# EAGLE design lp_numi (EAGLE 6.6.0)
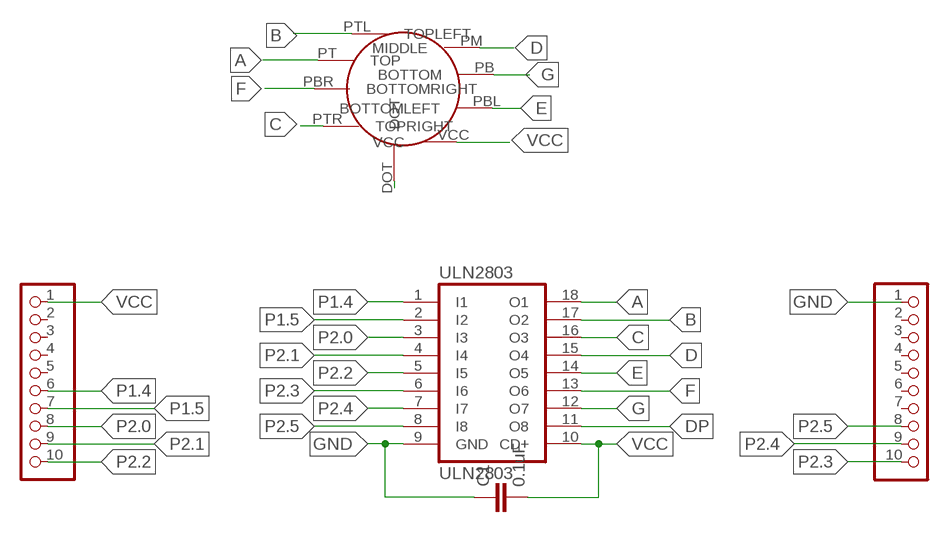
[diagram p0: schematic, sheet 1]

## Parts
C1  0.1uF  C-EU025-025X050  [C025-025X050]
J1  J1  PINHD-1X10  [1X10]
J2  J2  PINHD-1X10  [1X10]
U$2  IV16TINY_NUMITRON  [IV16TINY_NUMITRON_PAC]
ULN2803  ULN2803  ULN2803A  [DIL18]

## Nets
A: U$2.PT(TOP) ULN2803.18(O1)
B: U$2.PTL(TOPLEFT) ULN2803.17(O2)
C: U$2.PTR(TOPRIGHT) ULN2803.16(O3)
D: U$2.PM(MIDDLE) ULN2803.15(O4)
DP: U$2.DOT ULN2803.11(O8)
E: U$2.PBL(BOTTOMLEFT) ULN2803.14(O5)
F: U$2.PBR(BOTTOMRIGHT) ULN2803.13(O6)
G: U$2.PB(BOTTOM) ULN2803.12(O7)
GND: C1.1 J2.1 ULN2803.9(GND)
P1.4: J1.6 ULN2803.1(I1)
P1.5: J1.7 ULN2803.2(I2)
P2.0: J1.8 ULN2803.3(I3)
P2.1: J1.9 ULN2803.4(I4)
P2.2: J1.10 ULN2803.5(I5)
P2.3: J2.10 ULN2803.6(I6)
P2.4: J2.9 ULN2803.7(I7)
P2.5: J2.8 ULN2803.8(I8)
VCC [VCC]: C1.2 J1.1 U$2.VCC ULN2803.10(CD+)
Unconnected: J1.2 J1.3 J1.4 J1.5 J2.2 J2.3 J2.4 J2.5 J2.6 J2.7

## Library data of the parts
C1 = resistor:C-EU: CAPACITOR, European symbol
J1 J2 = pinhead:PINHD-1X10: PIN HEADER
U$2 = kalshagar:IV16TINY_NUMITRON
ULN2803 = uln-udn:ULN2803A: DRIVER ARRAY

## Net classes
0 default: width 0.406 mm, drill 0.508 mm
1 GND: width 0.813 mm, drill 0.508 mm
2 VCC: width 1.016 mm, drill 0.508 mm

## Board
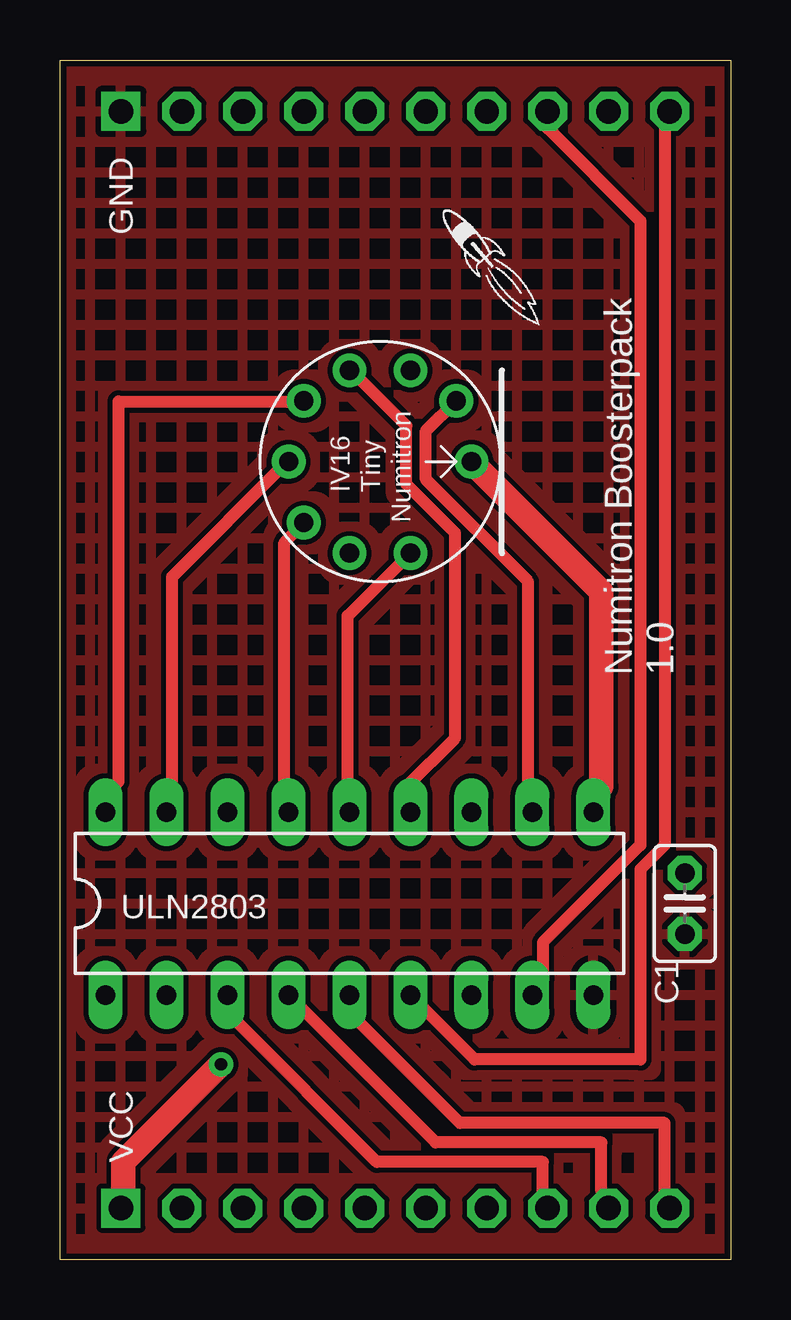
[diagram p1: board, top side]
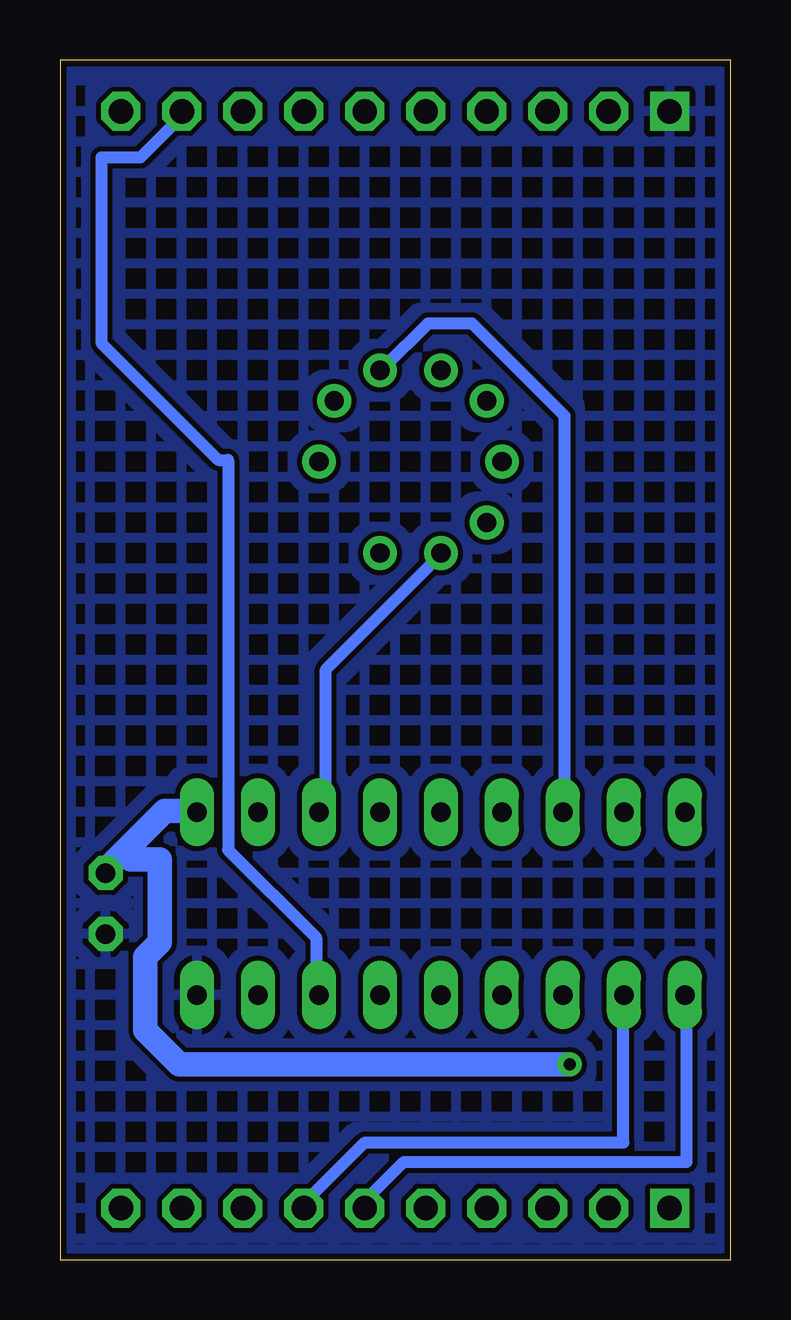
[diagram p2: board, bottom side, seen from below]

Size 27.94 x 50 mm. Coordinates in mm from the lower left corner, seen from the top.
Outline: 0,50 27.94,50 27.94,0 0,0 0,50
Copper layers (1*16): Top 0.035mm / dielectric 1.5mm / Bottom 0.035mm
Design rules "SparkFun *": minimum track width 20mil, minimum drill 20mil, track to track 8mil, track to pad 8mil, pad to pad 8mil, via to via 8mil, smd to smd 8mil, copper to edge 10mil, drill to drill 8mil, minimum pad ring 12mil, minimum via ring 10mil, stop-mask expansion 4mil, vias tented up to drill 25mil, thermal gap 10mil

### Footprints (pad centres in the part's own frame; a part is rotated, then mirrored left to right if it is on the bottom)
C025-025X050 = drill 0.813 octagon: 1 -1.27,0; 2 1.27,0
1X10 = drill 1.016 square: 1 -11.43,0 | drill 1.016 octagon: 2 -8.89,0; 3 -6.35,0; 4 -3.81,0; 5 -1.27,0; 6 1.27,0; 7 3.81,0; 8 6.35,0; 9 8.89,0; 10 11.43,0
IV16TINY_NUMITRON_PAC = drill 0.8: DOT 2.54,-3.175; PB -3.81,1.27; PBL -3.81,-1.27; PBR 3.81,1.27; PM -2.54,3.175; PT 2.54,3.175; PTL 0,3.81; PTR 3.81,-1.27; VCC 0,-3.81
DIL18 = drill 0.813 long: 1 -10.16,-3.81; 2 -7.62,-3.81; 3 -5.08,-3.81; 4 -2.54,-3.81; 5 0,-3.81; 6 2.54,-3.81; 7 5.08,-3.81; 8 7.62,-3.81; 9 10.16,-3.81; 10 10.16,3.81; 11 7.62,3.81; 12 5.08,3.81; 13 2.54,3.81; 14 0,3.81; 15 -2.54,3.81; 16 -5.08,3.81; 17 -7.62,3.81; 18 -10.16,3.81

### Placement (x,y rotation side)
C1  26.04,14.84 90 top
J1  13.97,2.14 0 top
J2  13.97,47.86 0 top
U$1  [LOGO-ROCKET]  17.78,41.51 90 top
U$2  13.34,33.26 90 top
ULN2803  12.06,14.84 0 top

### Tracks (layer width: path | path; a pad name or v marks a point on that pad's centre or on a via)
A
  Top 0.508: U$2.PT 10.16,35.77 2.44,35.77 2.44,19.92 2.03,19.51 2.03,18.7 ULN2803.18
B
  Top 0.508: U$2.PTL 9.35,33.13 4.67,28.45 4.67,18.9 4.47,18.7 ULN2803.17
C
  Bottom 0.508: U$2.PTR 14.43,37.19 12.6,39.02 10.77,39.02 6.91,35.16 6.91,18.7 ULN2803.16
D
  Top 0.508: U$2.PM 10.16,30.69 9.35,29.88 9.35,18.7 ULN2803.15
DP
  Top 0.508: U$2.DOT 16.46,35.77 15.24,34.55 15.24,32.52 19.51,28.25 19.51,18.7 ULN2803.11
E
  Top 0.508: U$2.PBL 11.99,26.83 11.99,18.7 ULN2803.14
F
  Top 0.508: U$2.PBR 12.19,36.99 14.43,34.75 14.43,32.32 16.46,30.28 16.46,21.75 14.43,19.72 14.43,18.7 ULN2803.13
G
  Bottom 0.508: U$2.PB 12.19,29.27 16.87,24.59 16.87,18.7 17.07,18.7 ULN2803.12
GND
  pour Bottom (hatched): 29.17,51.47 29.17,-1.67 -1.37,-1.77 -1.37,51.67 2.54,51.67
  pour Top (hatched): -1.37,51.47 29.21,51.47 29.21,-1.67 -1.37,-1.77
P1.4
  Bottom 0.508: J1.6 15.24,2.45 13.61,4.07 1.83,4.07 1.83,10.98 ULN2803.1
P1.5
  Bottom 0.508: ULN2803.2 4.47,10.98 4.47,4.88 15.24,4.88 17.88,2.24 J1.7
P2.0
  Top 0.508: ULN2803.3 7.11,10.98 7.32,10.78 7.32,9.96 13.21,4.07 20.12,4.07 20.12,2.45 20.32,2.24 J1.8
P2.1
  Top 0.508: ULN2803.4 9.55,10.98 15.65,4.88 22.55,4.88 22.55,2.85 22.76,2.65 22.76,2.24 J1.9
P2.2
  Top 0.508: ULN2803.5 12.19,10.98 12.39,10.78 12.39,9.96 16.66,5.7 25.2,5.7 25.2,2.45 25.4,2.24 J1.10
P2.3
  Top 0.508: ULN2803.6 14.63,10.98 17.27,8.34 24.18,8.34 24.18,16.26 25.2,17.28 25.2,47.55 25.4,47.76 J2.10
P2.4
  Bottom 0.508: ULN2803.7 17.27,11.18 17.27,13.42 20.93,17.08 20.93,33.33 21.34,33.33 26.21,38.21 26.21,45.93 24.59,45.93 22.76,47.76 J2.9
P2.5
  Top 0.508: J2.8 20.32,47.15 24.18,43.29 24.18,17.28 20.12,13.21 20.12,11.59 19.71,11.18 ULN2803.8
VCC  (via drill 0.51)
  Top 1.016: U$2.VCC 22.55,27.85 22.55,19.72 22.35,19.51 22.35,18.7 ULN2803.10 | v6.71,8.13 2.64,4.07 2.64,2.24 J1.1
  Bottom 1.016: 25.3,16.97 23.57,18.7 22.35,18.7 ULN2803.10 | 25.3,16.97 26.01,16.26 C1.2 | v6.71,8.13 22.96,8.13 24.38,9.56 24.38,12.61 23.77,13.21 23.77,16.67 24.99,16.67 25.3,16.97

### Text on the board
tNames: GND | Numitron Boosterpack / 1.0 | VCC